# Altium schematic sheet Battery Voltage Monitor.SchDoc: INA381A Overcurrent Protection
size Letter; SheetNumber: 21
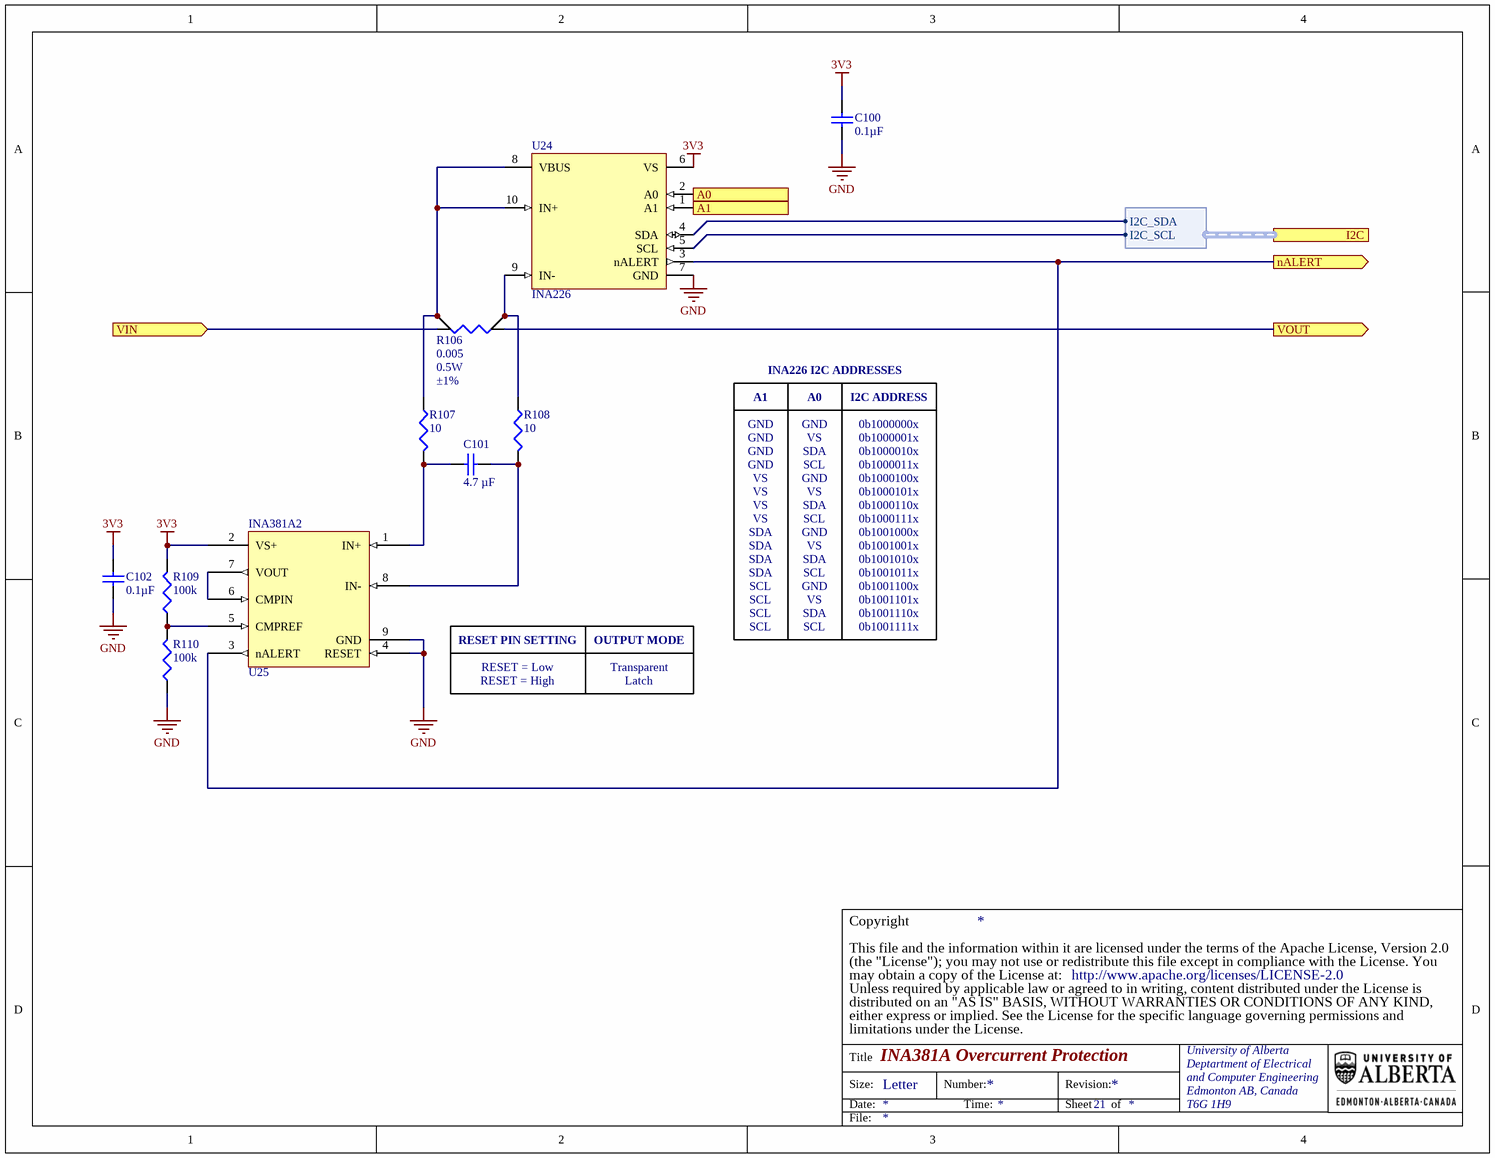
[diagram p0: Battery Voltage Monitor.SchDoc]

## Parts
C100  value 0.1µF  [TDK-CGA2B]  (hidden comment: Cap)
C101  value 4.7 µF  [MUR-GRM188]  (hidden comment: Cap)
C102  value 0.1µF  [TDK-CGA2B]  (hidden comment: Cap)
R106  value 0.005  Power - Rated: 0.5W  Tolerance: ±1%  [BRN-CRF0805]  (hidden comment: Res Sense)
R107  value 10  [PANA-ERA2A]  (hidden comment: Res3)
R108  value 10  [PANA-ERA2A]  (hidden comment: Res3)
R109  value 100k  [PANA-ERJ2R]  (hidden comment: Res3)
R110  value 100k  [PANA-ERJ2R]  (hidden comment: Res3)
U24  INA226  [TI-DGS]
U25  INA381A2  [TI-DSG0008A]

## Ports
A0 (in), A1 (in), I2C (harness INA226_I2C), nALERT (out), VIN (in), VOUT (out)

## Harnesses
INA226_I2C: I2C_SCL, I2C_SDA

## Nets
3V3: C100.2 C102.2 R109.2 U24.6(VS) U25.2(VS+)
GND: C100.1 C102.1 R110.1 U24.7(GND) U25.4(RESET) U25.9(GND)
A0: U24.2(A0) ; port A0
A1: U24.1(A1) ; port A1
nALERT: U24.3(nALERT) U25.3(nALERT) ; port nALERT
VIN: R106.2(I2) ; port VIN
VOUT: R106.1(I1) ; port VOUT
NetC101_1: C101.1 R108.2 U25.8(IN-)
NetC101_2: C101.2 R107.2 U25.1(IN+)
NetR106_3: R106.3(S2) R107.1 U24.8(VBUS) U24.10(IN+)
NetR106_4: R106.4(S1) R108.1 U24.9(IN-)
NetR109_1: R109.1 R110.2 U25.5(CMPREF)
NetU24_4: U24.4(SDA) ; port I2C.I2C_SDA
NetU24_5: U24.5(SCL) ; port I2C.I2C_SCL
NetU25_6: U25.6(CMPIN) U25.7(VOUT)

## Notes on the sheet
- INA226 I2C ADDRESSES
- A1
- GND
- A0
- VS
- I2C ADDRESS
- 0b1000000x
- 0b1000001x
- SDA
- SCL
- 0b1000010x
- 0b1000011x
- 0b1000100x
- 0b1000101x
- 0b1000110x
- 0b1000111x
- 0b1001000x
- 0b1001001x
- 0b1001010x
- 0b1001011x
- RESET PIN SETTING
- OUTPUT MODE
- 0b1001100x
- 0b1001101x
- 0b1001110x
- 0b1001111x
- RESET = Low
- RESET = High
- Transparent
- Latch
- (the "License"); you may not use or redistribute this file except in compliance with the License. You
- This file and the information within it are licensed under the terms of the Apache License, Version 2.0
- Copyright
- Unless required by applicable law or agreed to in writing, content distributed under the License is
- distributed on an "AS IS" BASIS, WITHOUT WARRANTIES OR CONDITIONS OF ANY KIND,
- either express or implied. See the License for the specific language governing permissions and
- limitations under the License.
- may obtain a copy of the License at:
- http://www.apache.org/licenses/LICENSE-2.0
- Title
- Size:
- Date:
- Letter
- Number:
- Time:
- Revision:
- Sheet
- of
- University of Alberta
- Deptartment of Electrical
- and Computer Engineering
- Edmonton AB, Canada
- T6G 1H9
- File:

## Library data of the parts
C100 C102 = PC-TDK-02259: CAP CER 0.1UF 50V X7R 0402; Manufacturer Part Number: CGA2B3X7R1H104K050BB; Index: 2259; Designator: C?; Tolerance: ±10%; Published: 2016-03-16; LatestRevisionDate: 2016-03-16; LatestRevisionNote: ...; PackageReference: 0402 (1005 Metric); Publisher: AlbertaSat; PackageDescription: Radial Cap, Thru-Hole; 2 Leads; 0.3 in Pin Spacing; Part Number: PC-TDK-02259; Supplier Part Number 1: 445-6899-1-ND; Supplier 1: Digi-key; Supplier Link: http://www.digikey.ca/product-search/en?keywords=445-6899-1-ND; Voltage - Rated: 50V; Temperature Coefficient: X7R; Applications: Automotive; Operating Temperature: -55°C ~ 125°C
C101 = 10165: CAP CER 4.7UF 16V X7R 0603; Part Number: 10165; Manufacturer Part Number: GRM188Z71C475KE21D; Designator: C?; Tolerance: ±10%; Voltage - Rated: 25V; Published: 8-Jun-2000; LatestRevisionDate: 17-Jul-2002; LatestRevisionNote: Re-released for DXP Platform.; PackageReference: 0603 (1608 Metric); Publisher: Altium Limited; PackageDescription: Chip Capacitor, 2-Leads, Body 1.60x0.80mm, IPC Low Density; Supplier Part Number 1: 490-GRM188Z71C475KE21DCT-ND; Supplier 1: Digi-Key; Supplier Link: #https://www.digikey.ca/en/products/detail/murata-electronics/GRM188Z71C475KE21D/13401930#; Temperature Coefficient: X7R; Application: General Purpose; Operating Temperature: -55°C ~ 125°C; Supplier 2: Mouser; Supplier Part Number 2: 81-GRM188Z71C475KE1D
R106 = PR-BRN-00023: RES 0.005 OHM 1% 1/2W 0805; Manufacturer Part Number: CRF0805-FZ-R005ELF; Index: 23; Designator: R?; Temperature Coefficient: ±50ppm/°C; Part Number: PR-BRN-00023; Supplier Part Number 1: CRF0805-FZ-R005ELFCT-ND; Supplier 1: Digi-key; Supplier Part Number 2: 652-CRF0805FZR005ELF; Supplier 2: Mouser; Publisher: AlbertaSat; Published: 2022-11-26; LatestRevisionDate: 2023-05-04; LatestRevisionNote: Added operating temperature; PackageReference: BRN-CRF0805; Supplier Link: #https://www.digikey.ca/en/products/detail/bourns-inc/CRF0805-FZ-R005ELF/6210977#; Operating Temperature: -55°C ~ 170°C
R107 R108 = 13235: RES SMD 10 OHM 0.5% 1/16W 0402; Part Number: 13235; Manufacturer Part Number: ERA-2AKD100X; Designator: R?; Power: 0.063W, 1/16W; Temperature Coefficient: ±100ppm/°C; Published: 8-Jun-2000; LatestRevisionDate: 29-May-2009; LatestRevisionNote: IPC-7351 Footprint Added.; PackageReference: 0402 (1005 Metric); Publisher: Altium Limited; PackageDescription: Chip Resistor, 2-Leads, Body 1.00x0.50mm, IPC Low Density; Supplier Part Number 1: P10DDCT-ND; Supplier 1: Digi-Key; Supplier Link: http://www.digikey.ca/product-search/en?keywords=P10DDCT-ND; Tolerance: ±0.5%; Operating Temperature: -55°C ~ 155°C
R109 R110 = 18739: RES SMD 100K OHM 1% 1/10W 0402; Part Number: 18739; Manufacturer Part Number: ERJ-2RKF1003X; Designator: R?; Power: 0.1W, 1/10W; Temperature Coefficient: ±100ppm/°C; Published: 8-Jun-2000; LatestRevisionDate: 29-May-2009; LatestRevisionNote: IPC-7351 Footprint Added.; PackageReference: 0402 (1005 Metric); Publisher: Altium Limited; PackageDescription: Chip Resistor, 2-Leads, Body 1.00x0.50mm, IPC Low Density; Supplier Part Number 1: P100KLCT-ND; Supplier 1: Digi-Key; Supplier Link: http://www.digikey.ca/product-search/en?keywords=P100KLCT-ND; Tolerance: ±1%; Operating Temperature: -55°C ~ 155°C
U24 = 19: IC MONITOR PWR/CURR BIDIR 10MSOP; Part Number: 19; Manufacturer Part Number: INA226AQDGSRQ1; Designator: U?; Supplier Part Number 2: 595-INA226AQDGSRQ1; Supplier 2: Mouser; Supplier Part Number 1: 296-42503-1-ND; Supplier 1: Digi-Key; Supplier Link: #https://www.digikey.com/product-detail/en/texas-instruments/INA226AQDGSRQ1/296-42503-1-ND/5416001#; PackageReference: TI-MSOP10; Operating Temperature: -40°C ~ 125°C
U25 = 110: CURRENT SENSE AMPLIFIER WITH INT; Part Number: 110; Manufacturer Part Number: INA381A2IDSGT; Designator: U?; Supplier Part Number 2: 595-INA381A2IDSGT; Supplier 2: Mouser; Supplier Part Number 1: 296-49078-1-ND; Supplier 1: Digi-Key; Supplier Link: #https://www.digikey.ca/product-detail/en/texas-instruments/INA381A2IDSGT/296-49078-1-ND/9091891#; PackageReference: 8-WFDFN Exposed Pad; Operating Temperature: -40°C ~ 125°C (TA)